# Altium schematic sheet Power.SchDoc
size A3; Organization: ElektronikLabor; SheetNumber: 2; SheetName: Power & Display
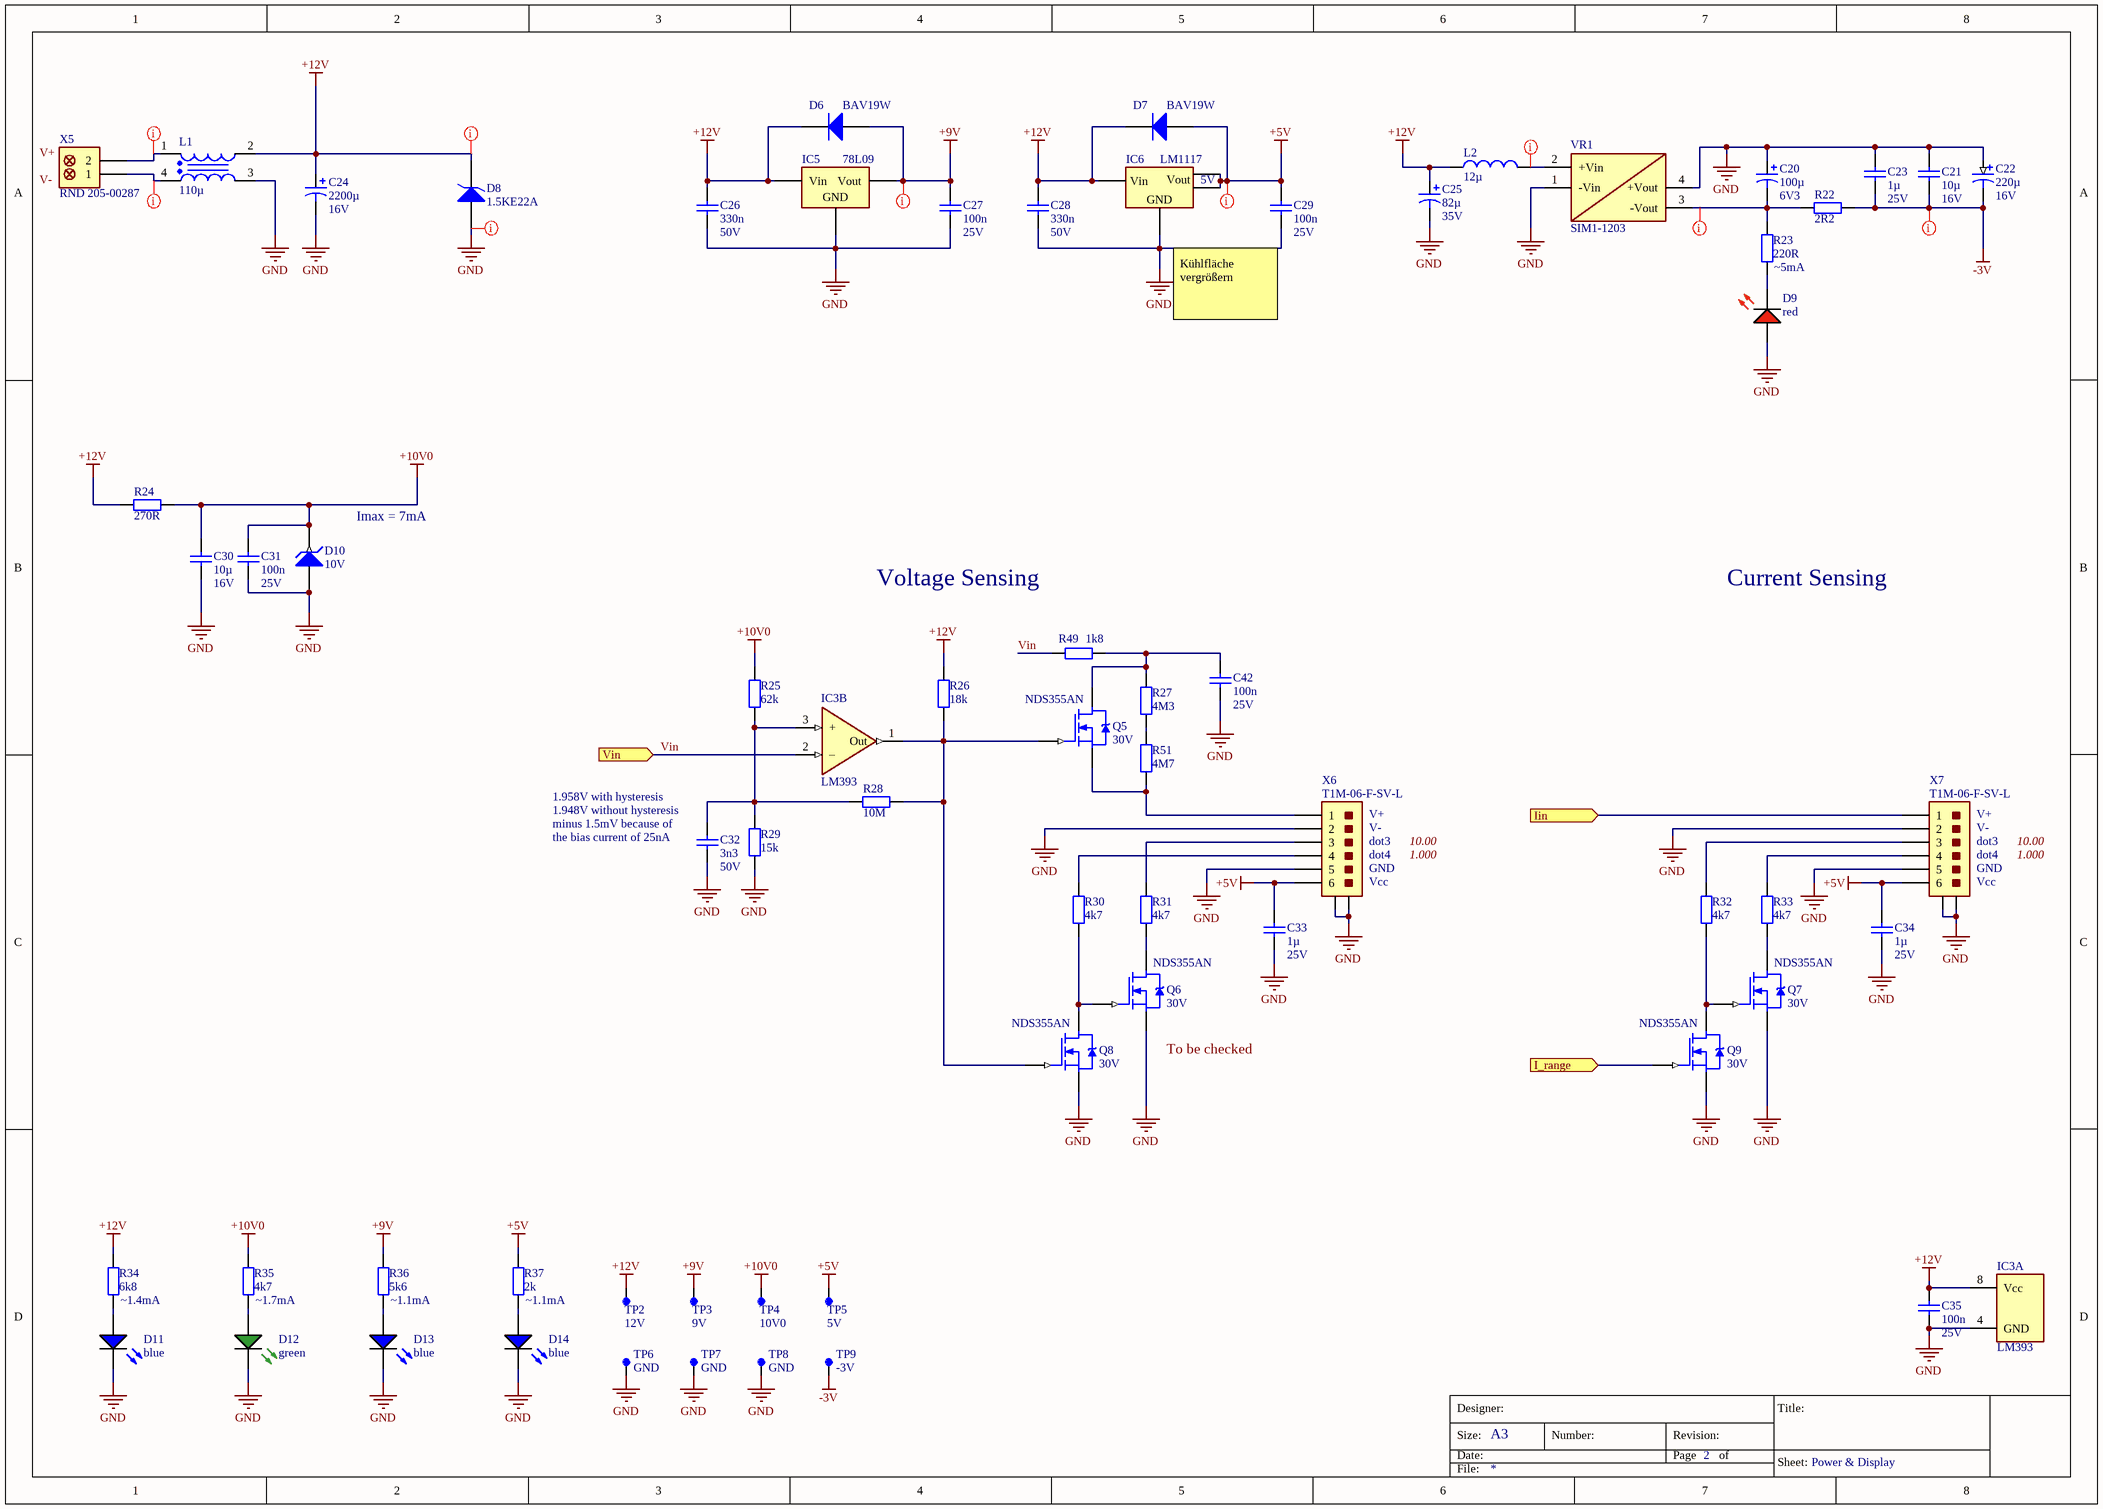
[diagram p0: Power.SchDoc]

## Parts
C20  100µ  Voltage: 6V3  [Cap ELCO 6.3x6 mm]
C21  10µ  Voltage: 16V  [C_1206]
C22  220µ  Voltage: 16V  [Cap Tantal E (2917)]
C23  1µ  Voltage: 25V  [C_0805]
C24  2200µ  Voltage: 16V  [Cap ELCO 12.5x20 mm]
C25  82µ  Voltage: 35V  [Cap ELCO 6.3x15 mm]
C26  330n  Voltage: 50V  [C_0805]
C27  100n  Voltage: 25V  [C_0805]
C28  330n  Voltage: 50V  [C_0805]
C29  100n  Voltage: 25V  [C_0805]
C30  10µ  Voltage: 16V  [C_1206]
C31  100n  Voltage: 25V  [C_0805]
C32  3n3  Voltage: 50V  [C_0805]
C33  1µ  Voltage: 25V  [C_0805]
C34  1µ  Voltage: 25V  [C_0805]
C35  100n  Voltage: 25V  [C_0805]
C42  100n  Voltage: 25V  [C_0805]
D6  BAV19W  [SOD-123]
D7  BAV19W  [SOD-123]
D8  1.5KE22A  [DO-201AD Vert]
D9  red  [LED 0805 SMD WL-SMCW]
D10  10V  [SOT23_N]
D11  blue  [LED 0805 SMD WL-SMCW]
D12  green  [LED 0805 SMD WL-SMCW]
D13  blue  [LED 0805 SMD WL-SMCW]
D14  blue  [LED 0805 SMD WL-SMCW]
IC3  LM393  [SOIC8_N]  (parts A,B of 3)
IC5  78L09  [TO-92A]
IC6  LM1117  Voltage: 5V  [SOT-223]
L1  110µ  [CMC WE-CMB Type S]
L2  12µ  [WE-GFH 4532]
Q5  NDS355AN  Voltage: 30V  [SOT23_N - n-MOS]
Q6  NDS355AN  Voltage: 30V  [SOT23_N - n-MOS]
Q7  NDS355AN  Voltage: 30V  [SOT23_N - n-MOS]
Q8  NDS355AN  Voltage: 30V  [SOT23_N - n-MOS]
Q9  NDS355AN  Voltage: 30V  [SOT23_N - n-MOS]
R22  2R2  [Res 0805]
R23  220R  [Res 0805]
R24  270R  [Res 0805]
R25  62k  [Res 0805]
R26  18k  [Res 0805]
R27  4M3  [Res 0805]
R28  10M  [Res 0805]
R29  15k  [Res 0805]
R30  4k7  [Res 0805]
R31  4k7  [Res 0805]
R32  4k7  [Res 0805]
R33  4k7  [Res 0805]
R34  6k8  [Res 0805]
R35  4k7  [Res 0805]
R36  5k6  [Res 0805]
R37  2k  [Res 0805]
R49  1k8  [Res 0805]
R51  4M7  [Res 0805]
TP2  12V  [Test Point SMD Rnd 1mm]  (no BOM)
TP3  9V  [Test Point SMD Rnd 1mm]  (no BOM)
TP4  10V0  [Test Point SMD Rnd 1mm]  (no BOM)
TP5  5V  [Test Point SMD Rnd 1mm]  (no BOM)
TP6  GND  [Test Point SMD Rnd 1mm]  (no BOM)
TP7  GND  [Test Point SMD Rnd 1mm]  (no BOM)
TP8  GND  [Test Point SMD Rnd 1mm]  (no BOM)
TP9  -3V  [Test Point SMD Rnd 1mm]  (no BOM)
VR1  SIM1-1203  [SIL-4]
X5  RND 205-00287  [TRMNL 5.08mm 2x]
X6  T1M-06-F-SV-L  [T1M-06-XX-S-V]
X7  T1M-06-F-SV-L  [T1M-06-XX-S-V]

## Ports
I_range (in), Iin (in), Vin (in)

## Nets
+5V: C29.1 C33.1 C34.1 D7.1(A) IC6.2(Vout) IC6.4(Vout) R37.1 TP5.1 X6.6 X7.6
+9V: C27.1 D6.1(A) IC5.1(Vout) R36.1 TP3.1
+10V0: C30.1 C31.1 D10.1(K) R24.2 R25.1 R35.1 TP4.1
+12V: C24.1 C25.1 C26.1 C28.1 C35.1 D6.2(K) D7.2(K) D8.K IC3.8(Vcc) IC5.3(Vin) IC6.3(Vin) L1.2 L2.1 R24.1 R26.1 R34.1 TP2.1
-3V: C21.2 C22.2 C23.2 R22.2 TP9.1
GND: C20.1 C21.1 C22.1 C23.1 C24.2 C25.2 C26.2 C27.2 C28.2 C29.2 C30.2 C31.2 C32.2 C33.2 C34.2 C35.2 C42.2 D8.A D9.2(A) D10.2(A) D11.1(K) D12.1(K) D13.1(K) D14.1(K) IC3.4(GND) IC5.2(GND) IC6.1(GND) L1.3 Q6.2(S) Q7.2(S) Q8.2(S) Q9.2(S) R29.2 TP6.1 TP7.1 TP8.1 VR1.1(-Vin) VR1.4(+Vout) X6.2 X6.5 X6.7(CASE) X6.8(CASE) X7.2 X7.5 X7.7(CASE) X7.8(CASE)
I_range: Q9.1(G) ; port I_range
Iin: X7.1 ; port Iin
Vin: IC3.2(–) R49.2 ; port Vin
NetC20_2: C20.2 R22.1 R23.1 VR1.3(-Vout)
NetC32_1: C32.1 IC3.3(+) R25.2 R28.1 R29.1
NetC42_1: C42.1 Q5.3(D) R27.2 R49.1
NetD9_1: D9.1(K) R23.2
NetD11_2: D11.2(A) R34.2
NetD12_2: D12.2(A) R35.2
NetD13_2: D13.2(A) R36.2
NetD14_2: D14.2(A) R37.2
NetIC3_1: IC3.1(Out) Q5.1(G) Q8.1(G) R26.2 R28.2
NetL1_1: L1.1 X5.2
NetL1_4: L1.4 X5.1
NetL2_2: L2.2 VR1.2(+Vin)
NetQ5_2: Q5.2(S) R51.2 X6.1
NetQ6_1: Q6.1(G) Q8.3(D) R30.2
NetQ6_3: Q6.3(D) R31.2
NetQ7_1: Q7.1(G) Q9.3(D) R32.2
NetQ7_3: Q7.3(D) R33.1
NetR27_1: R27.1 R51.1
NetR30_1: R30.1 X6.4
NetR31_1: R31.1 X6.3
NetR32_1: R32.1 X7.3
NetR33_2: R33.2 X7.4

## Layout directives
rule Width Constraint [Pref Width = 2mm    Min Width = 2mm    Max Width = 3mm]: NetL1_1, NetL1_4
rule Width Constraint [Pref Width = 1mm    Min Width = 0.5mm    Max Width = 2mm]: +5V, +9V
rule Width Constraint [Pref Width = 1mm    Min Width = 0.75mm    Max Width = 2mm]: NetC20_2
rule Width Constraint [Pref Width = 2mm    Min Width = 0.5mm    Max Width = 2mm]: -3V
rule Width Constraint [Pref Width = 2mm    Min Width = 0.5mm    Max Width = 3mm]; rule Clearance Constraint [Clearance = 0.3mm]: +12V
rule Width Constraint [Pref Width = 1mm    Min Width = 0.5mm    Max Width = 5mm]: GND
rule Width Constraint [Pref Width = 2mm    Min Width = 1mm    Max Width = 2mm]: NetL2_2

## Notes on the sheet
- (near X5) V+
- (near X5) V-
- Kühlfläche vergrößern
- (near R23) ~5mA
- Imax = 7mA
- Voltage Sensing
- Current Sensing
- (near C32) 1.958V with hysteresis
  1.948V without hysteresis
  minus 1.5mV because of
  the bias current of 25nA
- (near X6) V+
- (near X6) V-
- (near X6) dot3
- (near X6) dot4
- 1.000
- 10.00
- (near X7) V+
- (near X7) V-
- (near X7) dot3
- (near X7) dot4
- (near X6) GND
- (near X6) Vcc
- (near X7) GND
- (near X7) Vcc
- (near Q6) To be checked
- (near R34) ~1.4mA
- (near R35) ~1.7mA
- (near R36) ~1.1mA
- (near R37) ~1.1mA
- Size:
- Date:
- Designer:
- A3
- Number:
- Revision:
- Page
- of
- Title:
- File:
- Sheet:

## Library data of the parts
C20 = Cap Pol2 100µ: Cap Elco 100µ Radial; Manufacturer: Nichicon; PartNumber: UMA0J101MDD; Other: Available; Value: 100µ; ComponentLink1Description: Datasheet; ComponentLink1URL: G:\Daten\Datenblätter\Kondensatoren\Nichicon_UMA.pdf
C21 C30 = C-Cer 1206 16V 10µ: Cap Ceramic 1206 10µ 16V; PartNumber: CL31B106MOHNNNE; Manufacturer: Samsung; Temp. Coeff.: X7R; PackageReference: C1206; PackageDescription: Chip Capacitor; Value: 10µ; Supplier 1: Digi-Key; Supplier Part Number 1: 1276-6641-1-ND; Price [€]: 0,13
C22 = Cap Tantal 220µ: Cap Tantal 220µ 16V SMD; Manufacturer: AVX; PartNumber: TPSE227*016#0100; Value: 220µ; ComponentLink1Description: Datasheet; ComponentLink1URL: G:\Daten\Datenblätter\Kondensatoren\AVX_Tantal_TPS.pdf; Supplier Part Number 1: TPS 7343 220/16; Supplier 1: Reichelt; Price [€]: 1,15
C23 C33 C34 = C-Cer 0805 1µ: Cap Ceramic 0805 1µ 25V; Manufacturer: Samsung; PartNumber: CL21B105KAFNNNE; Temp. Coeff.: X7R; Tolerance: 10%; PackageReference: C0805; PackageDescription: Chip Capacitor; Value: 1µ; Supplier 1: Digi-Key; Supplier Part Number 1: 1276-1066-1-ND
C24 = Cap Pol 2200µ 16V: Cap Elco 2200µ 16V THT Radial; Manufacturer: Rubycon; PartNumber: UFW1C222MHD; Value: 2200µ; ComponentLink1Description: Datasheet; ComponentLink1URL: G:\Daten\Datenblätter\Kondensatoren\Nichicon_UFW.pdf; Supplier 1: Digi-Key; Supplier Part Number 1: 493-15122-ND; Price [€]: 0.77
C25 = Cap Pol2 82µ: Cap Elco 82µ Radial; Manufacturer: Nippon Chemi-Con; PartNumber: ELXY350ETD820MF15D; Other: Available; Value: 82µ; ComponentLink1Description: Datasheet; ComponentLink1URL: G:\Daten\Datenblätter\Kondensatoren\Chemi-Con_LXY.pdf
C26 C28 = C-Cer 0805 330n: Cap Ceramic 0805 330n 50V; Manufacturer: Samsung; PartNumber: CL21B334KBFNNNE; Temp. Coeff.: X7R; Tolerance: 10%; PackageReference: C0805; PackageDescription: Chip Capacitor; Value: 330n; Price [€]: 0,18; Supplier 1: Digi-Key; Supplier Part Number 1: 1276-1123-1-ND
C27 C29 C31 C35 C42 = C-Cer 0805 100n: Cap Ceramic 0805 100n 25V; Manufacturer: generic; Temp. Coeff.: X7R; PackageReference: C_0805; PackageDescription: Chip Capacitor; Value: 100n; PartNumber: generic
C32 = C-Cer 0805 3n3: Cap Ceramic 0805 3n3 50V; Manufacturer: generic; Temp. Coeff.: X7R; PackageReference: C0805; PackageDescription: Chip Capacitor; Value: 3n3; PartNumber: generic
D6 D7 = Diode BAV19W: Diode, Fast, 400mA, SOD-123, SMD; Manufacturer: Diodes; PartNumber: BAV19W-E3-08; Notes: Available; Voltage: 150V; ComponentLink1Description: Datasheet; ComponentLink1URL: G:\Daten\Datenblätter\Dioden\BAV19W.pdf; Current: 400mA; Value: BAV19W
D8 = Diode 1.5KE22A: Diode, TVS, Uni, 22V, CB429, THT; Manufacturer: ST; Current: 49A; Voltage: 18.8V; Power: 1.5kW; ComponentLink1Description: Datasheet; ComponentLink1URL: G:\Daten\Datenblätter\Dioden\1_5KE22A_TVS.pdf; PartNumber: 1.5KE22A; Value: 1.5KE22A; Supplier 1: Reichelt; Supplier Part Number 1: 1,5KE 22A
D9 = LED Red 0805 SMD: Manufacturer: Würth Elektronik; PartNumber: 150080SS75000; Voltage: 1.9V; Current: 30mA; Color: red; ComponentLink1Description: Datasheet; ComponentLink1URL: G:\Daten\Datenblätter\LED\0805_red_150080SS75000.pdf; Supplier 1: Digi-Key; Supplier Part Number 1: 732-4985-1-ND; Price [€]: 0,18
D10 = V-Ref LM4040AIM3-10.0: PartNumber: LM4040AIM3-10.0/NOPB; Manufacturer: Texas Instruments; Current: 5mA; Value: 10V; Supplier 1: Digi-Key; Price [€]: 1,53; ComponentLink1Description: Datasheet; ComponentLink1URL: G:\Daten\Datenblätter\Spg.-Referenz\TI_LM4040-N.pdf; Supplier Part Number 1: LM4040AIM3-10.0/NOPBCT-ND
D11 D13 D14 = LED Blue 0805 SMD: Manufacturer: Würth Elektronik; PartNumber: 150080BS75000; Voltage: 3.2V; Current: 30mA; Color: blue; ComponentLink1Description: Datasheet; ComponentLink1URL: G:\Daten\Datenblätter\LED\0805_blue_150080BS75000.pdf; Supplier 1: Digi-Key; Supplier Part Number 1: 732-4982-1-ND; Price [€]: 0,18
D12 = LED Green 0805 SMD: PartNumber: Generic; Voltage: 1.886V; Other: Available; Color: green; Manufacturer: Generic
IC3 = LM393DT: Comparator LM393DT 2x; Manufacturer: ST; Manufacturer_B: ROHM; Value: LM393; PartNumber: LM393DT; Price [€]: 0,44; ComponentLink1Description: Datasheet; ComponentLink1URL: G:\Daten\Datenblätter\Komparatoren\ST_LM393.pdf; Supplier 1: Digi-Key; Supplier Part Number 1: 497-1593-1-ND; PartNumber_B: LM393DT
IC5 = Volt Reg 78L09 TO92: Voltage Regulator 9V; Manufacturer: ST; PartNumber: L78L09ACZ; Current: 100mA; Other: Available; Value: 78L09; ComponentLink1Description: Datasheet; ComponentLink1URL: G:\Daten\Datenblätter\Spannungsregler\78L09_ST.pdf; Voltage: 9V
IC6 = Volt Reg LM1117MPX-5.0 SOT-223: Voltage Regulator 5V SOT-223; Manufacturer: Texas Instruments; PartNumber: L7805CV; Current: 800mA; Other: Available; ComponentLink1Description: Datasheet; ComponentLink1URL: G:\Daten\Datenblätter\Spannungsregler\LM1117.pdf; Value: LM1117; ComponentLink2URL: https://www.reichelt.de/ICs-LM-1000-LM-1999/LM-1117-MPX-5-0/3/index.html?ACTION=3&GROUPID=5465&ARTICLE=187609&OFFSET=75&; ComponentLink2Description: Supplier; Supplier Part Number 1: LM 1117 MPX-5.0; Supplier 1: Reichelt
L1 = CMC 110µ: Common Mode Choke, WE-CMB Type S, 110 uH; Manufacturer: Würth Elektronik; PartNumber: 744842311; RatedCurrent: 3A; Other: Available; PublishedDate: Nov. 2016; ComponentLink1Description: Manufacturer; ComponentLink1URL: http://www.we-online.de; ComponentLink2Description: Datasheet; ComponentLink2URL: http://katalog.we-online.de/pbs/datasheet/744842311.pdf; Size: Type S; Value: 110µ
L2 = Inductor 12µ: Inductor 12µ 7447669112 SMD; Manufacturer: Würth Elektronik; Current: 810mA; Value: 12µ; PartNumber: 7447669112; Price [€]: 0,43; ComponentLink1Description: Datasheet; ComponentLink1URL: G:\Daten\Datenblätter\Inductors\WE_7447669112_12µ.pdf; Supplier 1: Digi-Key; Supplier Part Number 1: 732-7321-1-ND
Q5-Q9 = Transistor n-MOS NDS355AN: Transistor n-MOS SOT-23 30V Vgs=20V; Manufacturer: ON Semiconductor; Note: Vgs_max = 20V; Current: 1.7A; PackageDescription: SOT-23; ComponentLink1Description: Datasheet; ComponentLink1URL: G:\Daten\Datenblätter\Transistoren\nMOS_NDS355AN.pdf; PartNumber: NDS355AN; Supplier 1: Digi-Key; Supplier Part Number 1: NDS355ANCT-ND; Price [€]: 0,39
R22 = Res 0805 2R2: Resistor 0805 2R2; Manufacturer: generic; Power: 0.125W; PartNumber: generic; Value: 2R2
R23 = Res 0805 220R: Resistor 0805 220R; Manufacturer: generic; Power: 0.125W; PartNumber: generic; Value: 220R
R24 = Res 0805 270R: Resistor 0805 270R; Manufacturer: generic; Power: 0.125W; PartNumber: generic; Value: 270R
R25 = Res 0805 62k: Resistor 0805 62k; Manufacturer: generic; Power: 0.125W; PartNumber: generic; Value: 62k
R26 = Res 0805 18k: Resistor 0805 18k; Manufacturer: generic; Power: 0.125W; PartNumber: generic; Value: 18k
R27 = Res 0805 4M3: Resistor 0805 4M3; Manufacturer: generic; Power: 0.125W; PartNumber: generic; Value: 4M3
R28 = Res 0805 10M: Resistor 0805 10M; Manufacturer: generic; Power: 0.125W; PartNumber: generic; Value: 10M
R29 = Res 0805 15k: Resistor 0805 15k; Manufacturer: generic; Power: 0.125W; PartNumber: generic; Value: 15k
R30-R33 R35 = Res 0805 4k7: Resistor 0805 4k7; Manufacturer: generic; Power: 0.125W; PartNumber: generic; Value: 4k7
R34 = Res 0805 6k8: Resistor 0805 6k8; Manufacturer: generic; Power: 0.125W; PartNumber: generic; Value: 6k8
R36 = Res 0805 5k6: Resistor 0805 5k6; Manufacturer: generic; Power: 0.125W; PartNumber: generic; Value: 5k6
R37 = Res 0805 2k: Resistor 0805 2k; Manufacturer: generic; Power: 0.125W; PartNumber: generic; Value: 2k
R49 = Res 0805 1k8: Resistor 0805 1k8; Manufacturer: generic; Power: 0.125W; PartNumber: generic; Value: 1k8
R51 = Res 0805 4M7: Resistor 0805 4M7; Manufacturer: generic; Power: 0.125W; PartNumber: generic; Value: 4M7
TP2-TP9 = Test Point
  TP2: SilkScreen: 12V
  TP3: SilkScreen: 9V
  TP4: SilkScreen: 10V0
  TP5: SilkScreen: 5V
  TP6-TP8: SilkScreen: GND
  TP9: SilkScreen: -3V
VR1 = DC/DC SIM1-1203: DC/DC Converter Isolated 3V; Manufacturer: HN Electronic Components; PartNumber: SIM1-1203-SIL4; Current: 300mA; Other: Available; ComponentLink1Description: Datasheet; ComponentLink1URL: G:\Daten\Datenblätter\DCDC_Converter\SIM1_1203.pdf; Voltage: 3V; Value: SIM1-1203
X5 = Termial 2pin 5.08mm: Terminal, 2-Pin, 5.08mm, THT; Manufacturer: RND connect; Current: 20A; ComponentLink1Description: Reichelt URL; ComponentLink1URL: https://www.reichelt.de/RND-connect/RND-205-00287/3/index.html?ACTION=3&GROUPID=7552&ARTICLE=170288&OFFSET=16&; PartNumber: RND 205-00287; ComponentLink2Description: Datasheet; ComponentLink2URL: G:\Daten\Datenblätter\Verbinder\Terminal_RND_205-00287.pdf; Price [€]: 0,41; Supplier 1: Reichelt; Supplier Part Number 1: RND 205-00287
X6 X7 = Con Male 6-Pin: Connector, Male, Vertical, 6-Pin, 1mm, SMD; Manufacturer: SAMTEC; MatingPartNumber: S1SS-06-L; PartNumber: T1M-06-F-SV-L; Value: T1M-06-F-SV-L; Supplier Part Number 1: T1M-06-F-SV-L; Supplier 1: SAMTEC; ComponentLink1Description: Datasheet; ComponentLink1URL: G:\Daten\Datenblätter\Steckverbinder\T1M-Single-Row.pdf